# EAGLE design mkii (EAGLE 6.4)
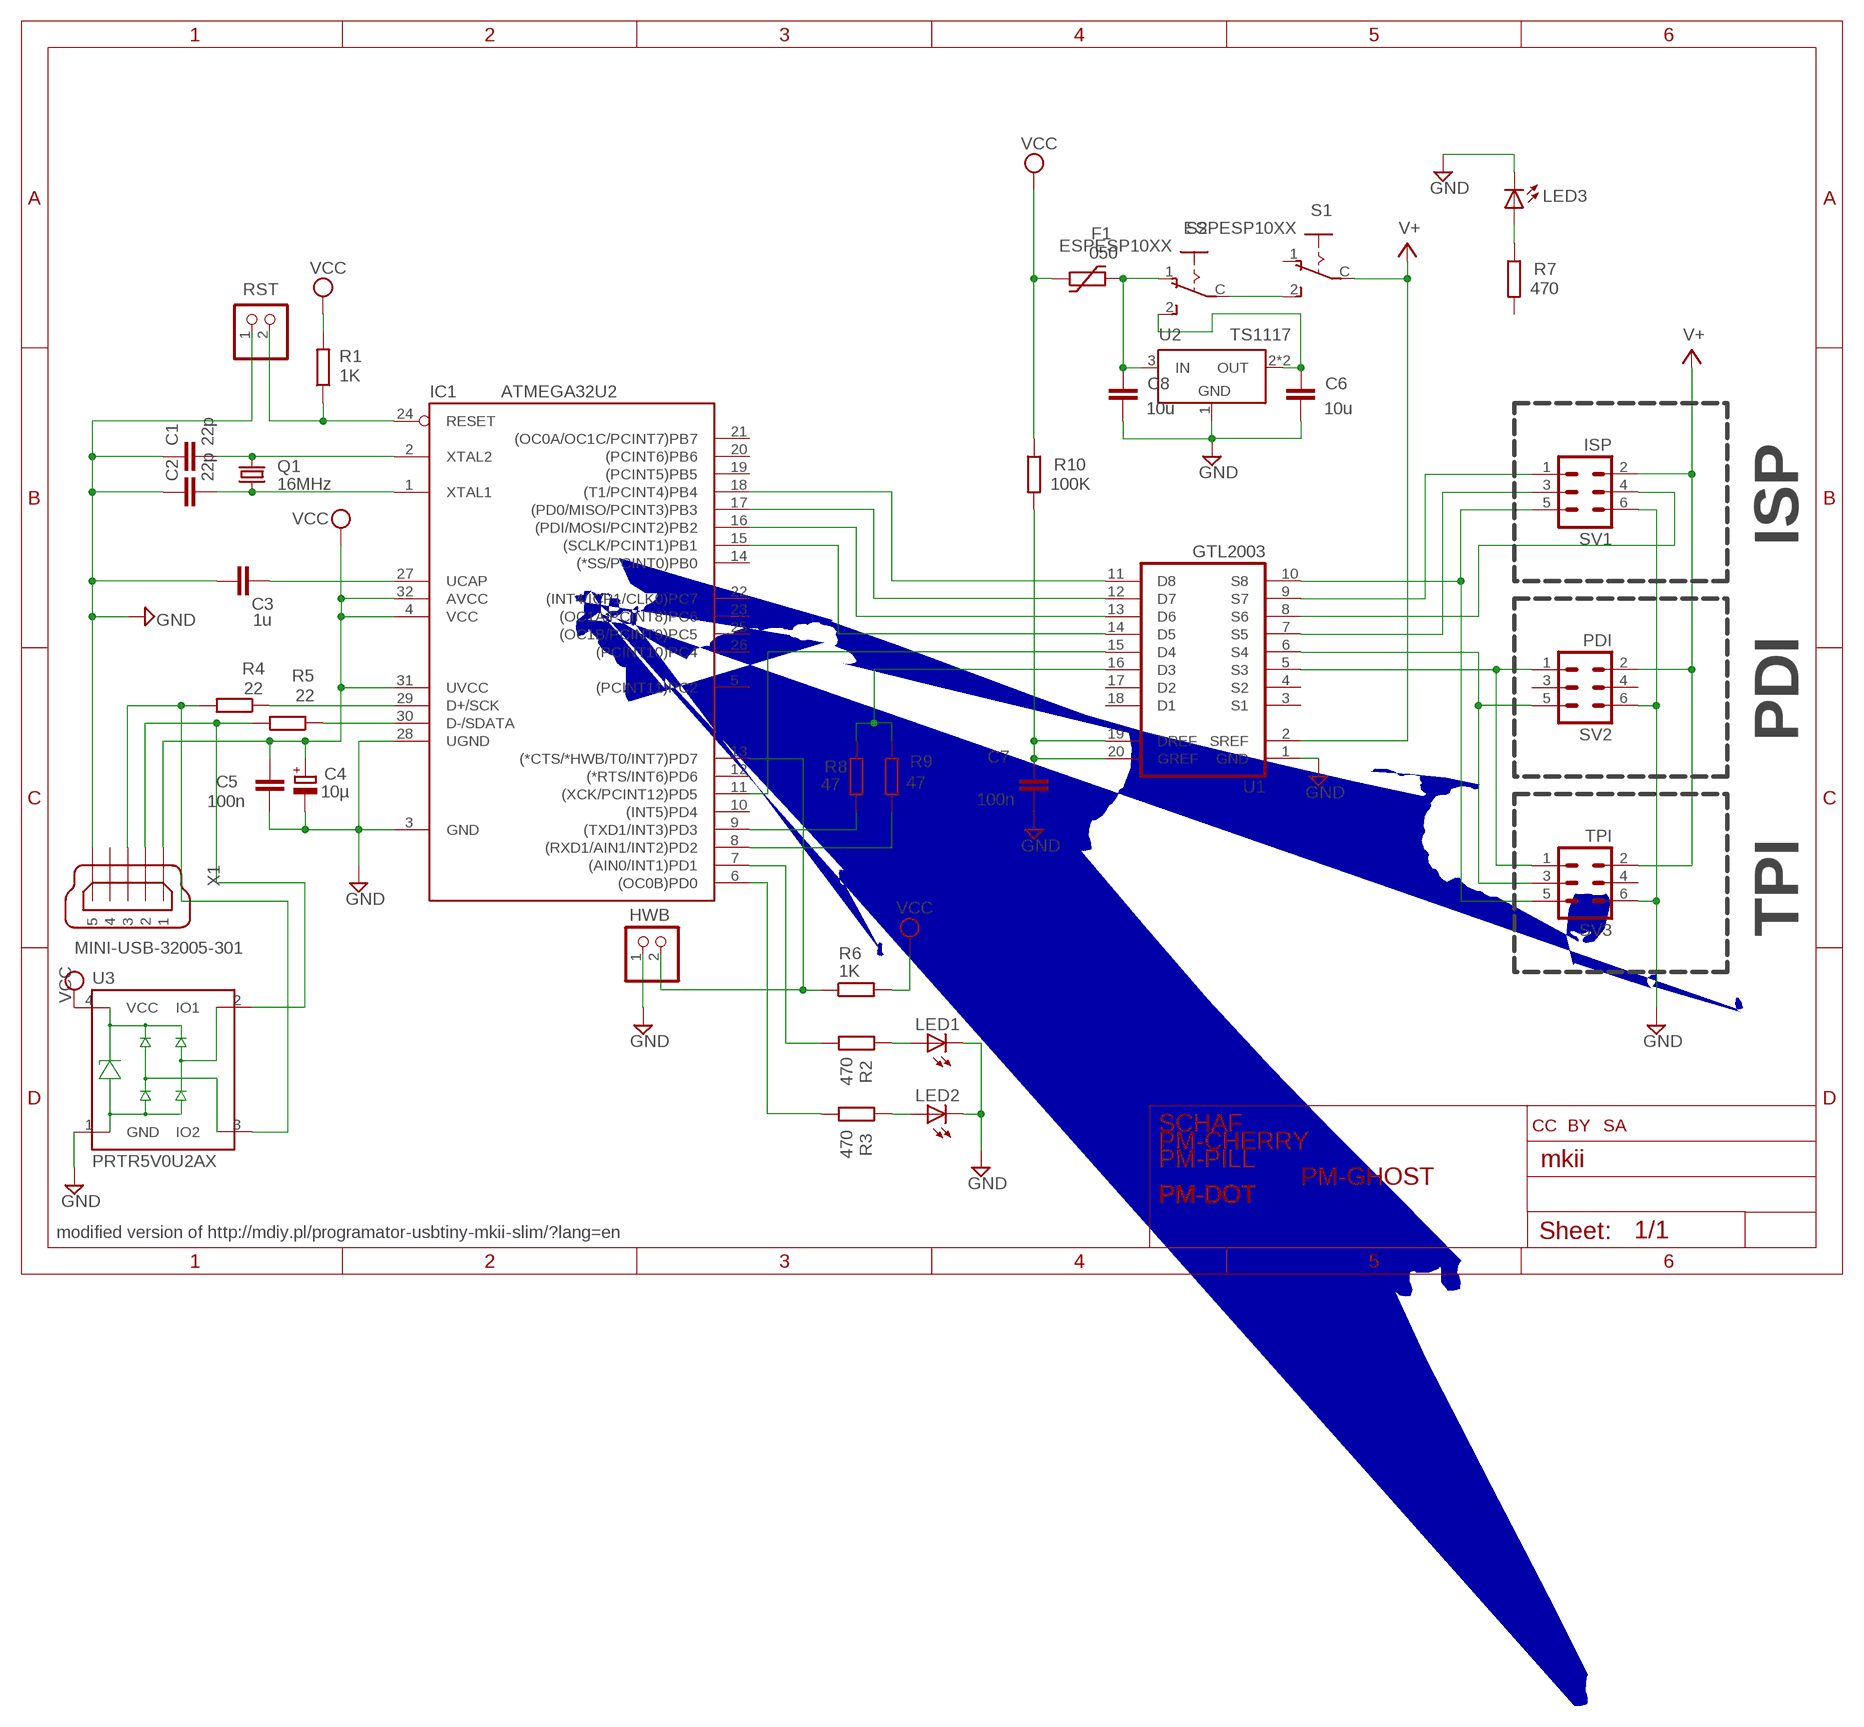
[diagram p0: schematic, sheet 1]

## Parts
C1  22p  C-EUC0603  [C0603]
C2  22p  C-EUC0603  [C0603]
C3  1u  C-EUC0805  [C0805]
C4  10µ  CPOL-EU153CLV-0505  [153CLV-0505]
C5  100n  C-EUC0603  [C0603]
C6  10u  C-EUC0805  [C0805]
C7  100n  C-EUC0603  [C0603]
C8  10u  C-EUC0805  [C0805]
F1  050  1812L  [1812L]
HWB  PINHD-1X02_2.54-S  [1X02-S]
IC1  ATMEGA32U2  AT90USB162-AU  [TQFP32-08]
LED1  LEDCHIP-LED0603  [CHIP-LED0603]
LED2  LEDCHIP-LED0603  [CHIP-LED0603]
LED3  LEDCHIP-LED0603  [CHIP-LED0603]
Q1  16MHz  CRYSTALHC49S  [HC49/S]
R1  1K  R-EU_R0603  [R0603]
R2  470  R-EU_R0603  [R0603]
R3  470  R-EU_R0603  [R0603]
R4  22  R-EU_R0603  [R0603]
R5  22  R-EU_R0603  [R0603]
R6  1K  R-EU_R0603  [R0603]
R7  470  R-EU_R0603  [R0603]
R8  47  R-EU_R0603  [R0603]
R9  47  R-EU_R0603  [R0603]
R10  100K  R-EU_R0603  [R0603]
RST  PINHD-1X02_2.54-S  [1X02-S]
S1  ESPESP10XX  [ESP10XX]
S2  ESPESP10XX  [ESP10XX]
SV1  ISP  ML6  [ML6]
SV2  PDI  ML6  [ML6]
SV3  TPI  ML6  [ML6]
U1  GTL2003  [TSSOP20]
U2  TS1117  [SOT223]
U3  PRTR5V0U2AX  [SOT143B]
U$1  CC-TPLACE-HALF  [CC_TPLACE_HS]
U$2  BY-TPLACE-HS  [BY_TPLACE_HS]
U$3  SA-TPLACE-HALF  [SA_TPLACE_HS]
U$4  SCHAF7MM  [SCHAF-7]
U$5  PM-CHERRY5  [PM-CHERRY-5]
U$6  PM-PILL5  [PM-PILL-5]
U$8  PM-DOT5  [PM-DOT5]
U$9  PM-DOT5  [PM-DOT5]
U$10  PM-DOT5  [PM-DOT5]
U$11  PM-DOT5  [PM-DOT5]
U$12  PM-DOT5  [PM-DOT5]
U$13  PM-DOT5  [PM-DOT5]
U$14  PM-DOT5  [PM-DOT5]
U$15  PM-DOT5  [PM-DOT5]
U$16  PM-GHOSTA5  [PM-GHOSTA-5]
X1  MINI-USB-32005-301  [32005-301]

## Nets
!RST: IC1.24(RESET) R1.1 RST.2
D+: IC1.29(D+/SCK) R4.1
D-: IC1.30(D-/SDATA) R5.1
GND [pwr]: C1.1 C2.1 C3.1 C4.- C5.1 C6.1 C7.1 C8.1 HWB.1 IC1.3(GND) IC1.28(UGND) LED1.C LED2.C LED3.C RST.1 SV1.6 SV2.6 SV3.6 U1.1(GND) U2.1(GND) U3.1(GND) X1.5
HWB: HWB.2 IC1.13((*CTS/*HWB/T0/INT7)PD7) R6.1
N$1: R4.2 U3.3(IO2) X1.3
N$2 [pwr]: S1.2(S) S2.C(P)
N$3: IC1.7((AIN0/INT1)PD1) R2.2
N$4: LED3.A R7.1
N$6 [pwr]: C8.2 F1.P$2 S2.1(O) U2.3(IN)
N$7: R5.2 U3.2(IO1) X1.2
N$9: IC1.9((TXD1/INT3)PD3) R8.2
N$11: IC1.6((OC0B)PD0) R3.2
N$12: LED1.A R2.1
N$13: LED2.A R3.1
N$15: C7.2 R10.2 U1.19(DREF) U1.20(GREF)
N$16: IC1.18((T1/PCINT4)PB4) U1.11(D8)
N$17: IC1.17((PD0/MISO/PCINT3)PB3) U1.12(D7)
N$18: IC1.16((PDI/MOSI/PCINT2)PB2) U1.13(D6)
N$19: IC1.15((SCLK/PCINT1)PB1) U1.14(D5)
N$20: IC1.11((XCK/PCINT12)PD5) U1.15(D4)
N$21: R8.1 R9.1 U1.16(D3)
N$25: SV2.1 SV3.1 U1.5(S3)
N$26: SV2.5 SV3.3 U1.6(S4)
N$27: SV1.5 SV3.5 U1.10(S8)
N$28: SV1.1 U1.9(S7)
N$29: SV1.4 U1.8(S6)
N$30: SV1.3 U1.7(S5)
N$31: IC1.8((RXD1/AIN1/INT2)PD2) R9.2
N$32 [pwr]: C6.2 S2.2(S) U2.2(OUT) U2.4(OUT)
UCAP: C3.2 IC1.27(UCAP)
V+ [pwr]: S1.C(P) SV1.2 SV2.2 SV3.2 U1.2(SREF)
VCC [pwr]: C4.+ C5.2 F1.P$1 IC1.4(VCC) IC1.31(UVCC) IC1.32(AVCC) R1.2 R6.2 R10.1 U3.4(VCC) X1.1
XTAL1: C2.2 IC1.1(XTAL1) Q1.1
XTAL2: C1.2 IC1.2(XTAL2) Q1.2
Unconnected: IC1.5((PCINT11)PC2) IC1.10((INT5)PD4) IC1.12((*RTS/INT6)PD6) IC1.14((*SS/PCINT0)PB0) IC1.19((PCINT5)PB5) IC1.20((PCINT6)PB6) IC1.21((OC0A/OC1C/PCINT7)PB7) IC1.22((INT4/ICP1/CLK0)PC7) IC1.23((OC1A/PCINT8)PC6) IC1.25((OC1B/PCINT9)PC5) IC1.26((PCINT10)PC4) R7.2 S1.1(O) SV2.3 SV2.4 SV3.4 U1.3(S1) U1.4(S2) U1.17(D2) U1.18(D1) X1.4

## Notes on the sheet
- ISP
- PDI
- TPI
- modified version of http://mdiy.pl/programator-usbtiny-mkii-slim/?lang=en

## Library data of the parts
C1-C3 C5-C8 = rcl:C-EU: CAPACITOR, European symbol
C4 = rcl:CPOL-EU: POLARIZED CAPACITOR, European symbol
F1 = ptc-littlefuse:1812L
HWB RST = pinhead-2:PINHD-1X02: PIN HEADER
IC1 = at90usb:AT90USB162-*
LED1-LED3 = led:LED: LED OSRAM: - CHIPLED LG R971, LG N971, LY N971, LG Q971, LY Q971, LO R971, LY R971 LH N974, LH R974 LS Q976, LO Q976, LY Q976 LO Q996 - Hyper CHIPLED LW Q18S LB Q993, LB Q99A, LB R99A - SideLED LS A670, LO A670, LY A670, LG A670, LP A670 LB A673, LV A673, LT A673, LW A673 LH A674 LY A675 LS A676, LA A676, LO A676, LY A676, LW A676 LS A679, LY A679, LG A679 - Hyper Micro SIDELED® LS Y876, LA Y876, LO Y876, LY Y876 LT Y87S - SmartLED LW L88C, LW L88S LB L89C, LB L89S, LG L890 LS L89K, LO L89K, LY L89K LS L896, LA L896, LO L896, LY L896 - TOPLED LS T670, LO T670, LY T670, LG T670, LP T670 LSG T670, LSP T670, LSY T670, LOP T670, LYG T670 LG T671, LOG T671, LSG T671 LB T673, LV T673, LT T673, LW T673 LH T674 LS T676, LA T676, LO T676, LY T676, LB T676, LH T676, LSB T676, LW T676 LB T67C, LV T67C, LT T67C, LS T67K, LO T67K, LY T67K, LW E67C LS E67B, LA E67B, LO E67B, LY E67B, LB E67C, LV E67C, LT E67C LW T67C LS T679, LY T679, LG T679 LS T770, LO T770, LY T770, LG T770, LP T770 LB T773, LV T773, LT T773, LW T773 LH T774 LS E675, LA E675, LY E675, LS T675 LS T776, LA T776, LO T776, LY T776, LB T776 LHGB T686 LT T68C, LB T68C - Hyper Mini TOPLED® LB M676 - Mini TOPLED Santana® LG M470 LS M47K, LO M47K, LY M47K Source: http://www.osram.convergy.de LUXEON: - LUMILED® LXK2-PW12-R00, LXK2-PW12-S00, LXK2-PW14-U00, LXK2-PW14-V00 LXK2-PM12-R00, LXK2-PM12-S00, LXK2-PM14-U00 LXK2-PE12-Q00, LXK2-PE12-R00, LXK2-PE12-S00, LXK2-PE14-T00, LXK2-PE14-U00 LXK2-PB12-K00, LXK2-PB12-L00, LXK2-PB12-M00, LXK2-PB14-N00, LXK2-PB14-P00, LXK2-PB14-Q00 LXK2-PR12-L00, LXK2-PR12-M00, LXK2-PR14-Q00, LXK2-PR14-R00 LXK2-PD12-Q00, LXK2-PD12-R00, LXK2-PD12-S00 LXK2-PH12-R00, LXK2-PH12-S00 LXK2-PL12-P00, LXK2-PL12-Q00, LXK2-PL12-R00 Source: www.luxeon.com KINGBRIGHT: KA-3528ASYC Source: www.kingbright.com
Q1 = crystal:CRYSTAL: CRYSTAL; OC_FARNELL: 1667008; OC_NEWARK: unknown
R1-R10 = rcl:R-EU_: RESISTOR, European symbol
S1 S2 = schalter:ESP
SV1-SV3 = con-ml:ML6: HARTING; OC_FARNELL: unknown; OC_NEWARK: unknown
U1 = manekinen_diy:GTL2003: "8-bit bidirectional low voltage translator"
U2 = TS1117:TS1117
U3 = nxp:PRTR5V0U2AX
U$1 = creative-commons:CC: creatice commons - CC
U$2 = creative-commons:BY: creative commons Attribution - BY
U$3 = creative-commons:SA: creative commons ShareAlike - SA
U$4 = grafiken:SCHAF: Quelle: http://www.schulbilder.org/malvorlage-schaaf-i17791.html
U$5 = grafiken:PM-CHERRY
U$6 = grafiken:PM-PILL
U$8-U$15 = grafiken:PM-DOT
U$16 = grafiken:PM-GHOST
X1 = con-cypressindustries:MINI-USB-: MINI USB-B Conector Source: www.cypressindustries.com; OC_FARNELL: unknown; OC_NEWARK: unknown

## Net classes
0 default: width 0.152 mm
1 pwr: width 0.254 mm

## Board
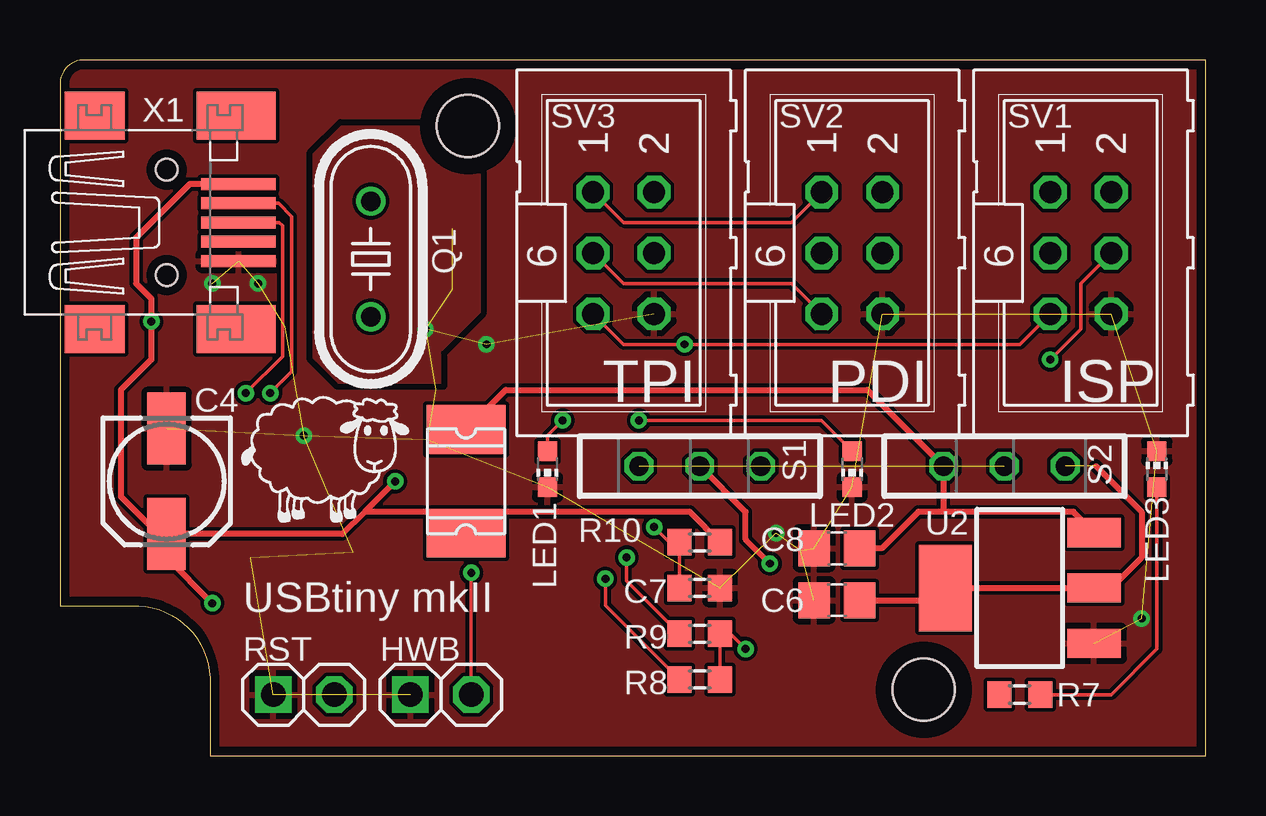
[diagram p1: board, top side]
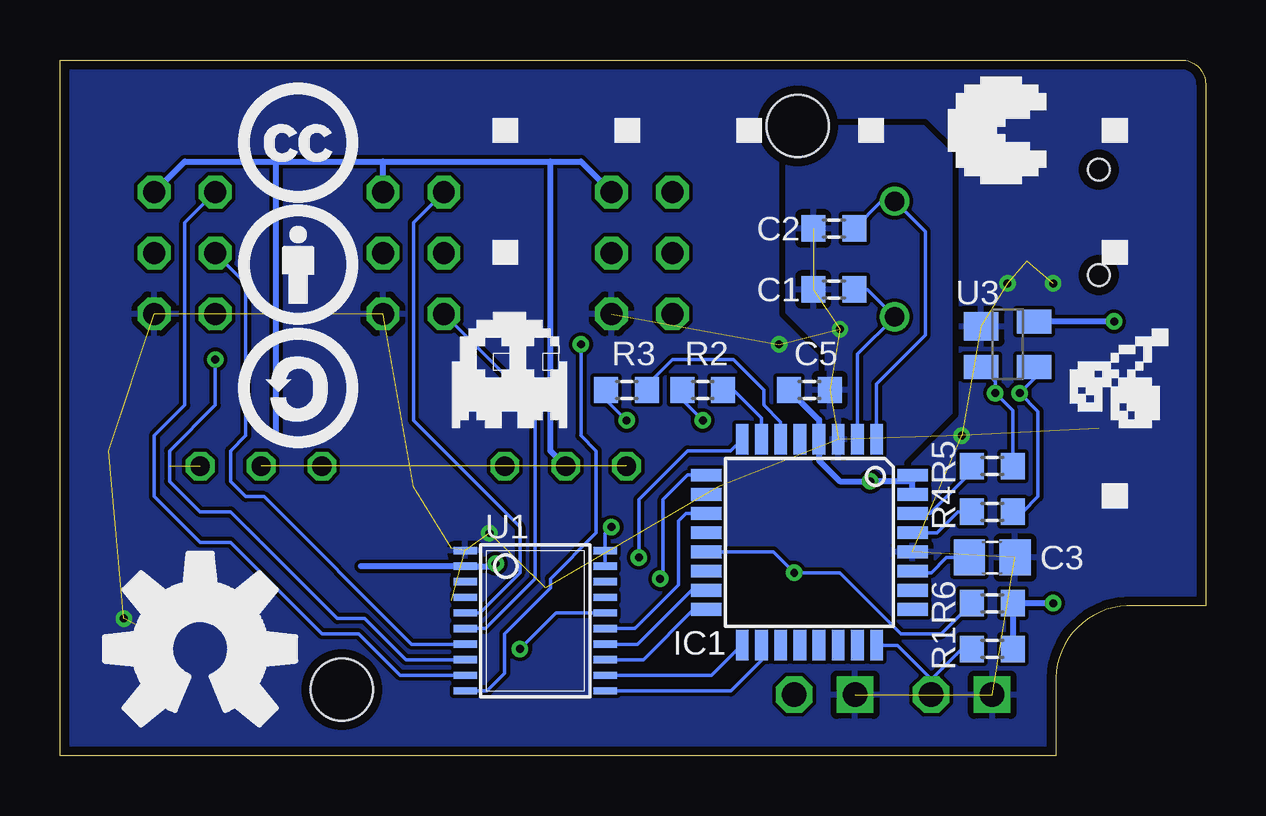
[diagram p2: board, bottom side, seen from below]

Size 47.75 x 29 mm. Coordinates in mm from the lower left corner, seen from the top.
Outline: 0,6.25 3,6.25 arc-90 6.25,3.25 6.25,0 47.75,0 47.75,29 1,29 arc90 0,28 0,6.25
Copper layers (1*16): Top 0.0356mm / dielectric 1.5011mm / Bottom 0.0356mm
Design rules "oshpark": minimum track width 6mil, minimum drill 13mil, track to track 6mil, track to pad 6mil, pad to pad 6mil, via to via 6mil, smd to smd 6mil, copper to edge 15mil, drill to drill 6mil, minimum pad ring 7mil, minimum via ring 7mil, stop-mask expansion 4mil, vias tented up to drill 0mil, thermal gap 10mil
Holes 2.6 mm at 17,26.25 36,2.75
tRestrict: area 34.8,1.5 to 37.2,4; area 15.8,25 to 18.2,27.5; 9 lines
bRestrict: 8 lines

### Footprints (pad centres in the part's own frame; a part is rotated, then mirrored left to right if it is on the bottom)
C0603 = smd 1 x 1.1: 1 -0.85,0; 2 0.85,0
C0805 = smd 1.3 x 1.5: 1 -0.95,0; 2 0.95,0
153CLV-0505 = smd 3 x 1.6: + 2.2,0; - -2.2,0
1812L = smd 2.03 x 3.3: P$1 -2.16,0; P$2 2.16,0
1X02-S = drill 1.016 square: 1 -1.27,0 | drill 1.016 octagon: 2 1.27,0
TQFP32-08 = smd 1.27 x 0.533: 1 -4.293,2.8; 2 -4.293,2; 3 -4.293,1.2; 4 -4.293,0.4; 5 -4.293,-0.4; 6 -4.293,-1.2; 7 -4.293,-2; 8 -4.293,-2.8; 17 4.293,-2.8; 18 4.293,-2; 19 4.293,-1.2; 20 4.293,-0.4; 21 4.293,0.4; 22 4.293,1.2; 23 4.293,2; 24 4.293,2.8 | smd 0.533 x 1.27: 9 -2.8,-4.293; 10 -2,-4.293; 11 -1.2,-4.293; 12 -0.4,-4.293; 13 0.4,-4.293; 14 1.2,-4.293; 15 2,-4.293; 16 2.8,-4.293; 25 2.8,4.293; 26 2,4.293; 27 1.2,4.293; 28 0.4,4.293; 29 -0.4,4.293; 30 -1.2,4.293; 31 -2,4.293; 32 -2.8,4.293
CHIP-LED0603 = smd 0.8 x 0.8: A 0,-0.75; C 0,0.75
HC49/S = drill 0.813: 1 -2.413,0; 2 2.413,0
R0603 = smd 1 x 1.1: 1 -0.85,0; 2 0.85,0
ESP10XX = drill 0.8 octagon: 1 -2.54,0; 2 2.54,0; C 0,0
ML6 = drill 0.914 octagon: 1 -2.54,-1.27; 2 -2.54,1.27; 3 0,-1.27; 4 0,1.27; 5 2.54,-1.27; 6 2.54,1.27
TSSOP20 = smd 0.991 x 0.305: 1 -2.918,2.925; 2 -2.918,2.275; 3 -2.918,1.625; 4 -2.918,0.975; 5 -2.918,0.325; 6 -2.918,-0.325; 7 -2.918,-0.975; 8 -2.918,-1.625; 9 -2.918,-2.275; 10 -2.918,-2.925; 11 2.918,-2.925; 12 2.918,-2.275; 13 2.918,-1.625; 14 2.918,-0.975; 15 2.918,-0.325; 16 2.918,0.325; 17 2.918,0.975; 18 2.918,1.625; 19 2.918,2.275; 20 2.918,2.925
SOT223 = smd 1.219 x 2.235: 1 -2.311,-3.099; 2 0,-3.099; 3 2.311,-3.099 | smd 3.6 x 2.2: 4 0,3.099
SOT143B = smd 1.2 x 1.44: 1 -0.75,-1.1 | smd 1 x 1.44: 2 0.95,-1.1; 3 0.95,1.1; 4 -0.95,1.1
32005-301 = smd 3.1 x 0.5: 1 3,1.6; 2 3,0.8; 3 3,0; 4 3,-0.8; 5 3,-1.6 | smd 2.5 x 2: M1 -3,-4.45; M2 -3,4.45 | smd 3.3 x 2: M3 2.9,4.45; M4 2.9,-4.45 | hole 0.9: 0,2.2; 0,-2.2

### Placement (x,y rotation side)
C1  15.49,19.43 0 bottom
C2  15.49,21.97 0 bottom
C3  8.89,8.26 180 bottom
C4  4.45,11.43 270 top
C5  16.51,15.24 180 bottom
C6  32.38,6.48 0 top
C7  26.67,6.99 180 top
C8  32.38,8.64 0 top
F1  16.92,11.43 90 top
HWB  15.88,2.54 0 top
IC1  16.51,8.89 270 bottom
LED1  20.32,11.94 180 top
LED2  33.02,11.94 180 top
LED3  45.72,11.94 0 top
Q1  12.95,20.7 270 top
R1  8.89,4.45 0 bottom
R2  20.95,15.24 0 bottom
R3  24.13,15.24 0 bottom
R4  8.89,10.16 0 bottom
R5  8.89,12.06 0 bottom
R6  8.89,6.35 0 bottom
R7  40.01,2.54 180 top
R8  26.67,3.17 180 top
R9  26.67,5.08 180 top
R10  26.67,8.89 180 top
RST  10.16,2.54 0 top
S1  26.67,12.06 180 top
S2  39.37,12.06 0 top
SV1  42.55,20.95 270 top
SV2  33.02,20.95 270 top
SV3  23.5,20.95 270 top
U1  27.94,5.62 0 bottom
U2  40.01,6.99 90 top
U3  8.26,17.14 270 bottom
U$1  40.32,23.05 0 bottom
U$2  40.32,17.97 0 bottom
U$3  40.32,12.83 0 bottom
U$4  7.56,9.72 0 top
U$5  6.35,13.34 0 bottom
U$6  11.43,23.5 0 bottom
U$8  6.35,8.26 0 bottom
U$9  16.51,23.5 0 bottom
U$10  21.59,23.5 0 bottom
U$11  6.35,23.5 0 bottom
U$12  26.67,23.5 0 bottom
U$13  6.35,18.41 0 bottom
U$14  31.75,18.41 0 bottom
U$15  31.75,23.5 0 bottom
U$16  31.75,13.34 0 bottom
X1  4.45,22.23 0 top

### Tracks (layer width: path | path; a pad name or v marks a point on that pad's centre or on a via)
!RST
  Bottom 0.152: 13.71,4.18 IC1.24 12.85,4.6 11.43,3.17 | R1.1 10.16,4.45 11.43,3.17 | RST.2 11.43,3.17
D+
  Bottom 0.152: IC1.29 11.2,9.29 10.32,10.16 R4.1
D-
  Bottom 0.152: IC1.30 11.5,10.09 9.74,11.85 R5.1
GND  (via drill 0.33)  (28 unrouted)
  other vias: 29.84,9.27 6.35,19.68 8.26,19.68 15.24,17.78 17.78,17.14 10.16,13.34 45.09,5.71
  pour Top (rank 6): 0,0 0,29 54,29 53.98,0
  pour Bottom (rank 6): -1,30 55,30 55,-1 -1,-1
  pour Top: 14.22,15.24 11.81,15.24 10.67,16.38 10.67,25.02 11.81,26.16 16,26.16 17.14,25.02 17.14,18.29 14.73,15.88
HWB  (via drill 0.33)
  Top 0.152: HWB.2 v17.14,7.62
  Bottom 0.152: R6.1 11.01,5.08 12.7,5.08 15.24,7.62 v17.14,7.62 18.02,8.49 IC1.13
N$1  (via drill 0.33)
  Top 0.152: X1.3 9.14,22.23 9.27,22.1 9.27,16.64 v7.75,15.11
  Bottom 0.152: R4.2 7.62,10.16 6.99,10.79 6.99,14.35 v7.75,15.11 7.16,15.71 U3.3
N$2  (1 unrouted)
N$3
  Bottom 0.152: IC1.7 18.51,14.06 19.68,15.24 R2.2
N$4
  Top 0.152: LED3.A 45.72,4.45 43.81,2.54 R7.1
N$6
  Top 0.254: F1.P$2 18.57,15.24 33.66,15.24 S2.1 36.83,10.16 | 33.02,9.11 C8.2 34.25,8.64 35.77,10.16 36.83,10.16 | U2.3 42.24,10.16 36.83,10.16
N$7  (via drill 0.33)
  Top 0.152: X1.2 9.11,23.02 9.65,22.48 9.65,16 v8.76,15.11
  Bottom 0.152: R5.2 8.04,14.39 v8.76,15.11 8.76,15.6 U3.2
N$9  (via drill 0.33)
  Top 0.152: v22.73,7.37 22.73,6.26 R8.2
  Bottom 0.152: v22.73,7.37 22.61,7.49 22.61,10.67 21.58,11.69 IC1.9
N$11
  Bottom 0.152: IC1.6 17.71,13.9 18.41,14.61 18.41,15.24 19.68,16.51 22.23,16.51 23.28,15.46 R3.2
N$12  (via drill 0.33)
  Top 0.152: v20.95,13.97 20.32,13.34 LED1.A
  Bottom 0.152: R2.1 21.8,14.82 v20.95,13.97
N$13  (via drill 0.33)
  Top 0.152: v24.13,13.97 31.74,13.97 LED2.A
  Bottom 0.152: R3.1 24.98,14.82 v24.13,13.97
N$15  (via drill 0.33)
  Top 0.152: C7.2 R10.2 25.82,8.47 v24.77,9.53
  Bottom 0.152: v24.77,9.53 25.02,9.27 U1.20 U1.19
N$16
  Bottom 0.152: IC1.18 18.51,3.97 19.78,2.69 U1.11
N$17
  Bottom 0.152: IC1.17 19.33,4.62 20.6,3.35 U1.12
N$18
  Bottom 0.152: IC1.16 21.34,6.09 23.44,4 U1.13
N$19
  Bottom 0.152: U1.14 23.68,4.64 21.43,6.89 IC1.15
N$20
  Bottom 0.152: U1.15 23.79,5.29 21.97,7.11 21.97,9.78 21.66,10.09 IC1.11 21.28,10.09
N$21  (via drill 0.33)
  Top 0.152: v28.57,4.45 27.94,5.08 R9.1 R8.1
  Bottom 0.152: U1.16 27.07,5.95 v28.57,4.45
N$25
  Top 0.152: SV3.1 23.5,22.23 30.48,22.23 SV2.1
  Bottom 0.152: SV2.1 33.02,22.23 33.02,13.97 28.57,9.53 28.57,7.62 30.25,5.95 U1.5
N$26
  Top 0.152: SV2.5 30.48,19.68 23.5,19.68 SV3.3
  Bottom 0.152: U1.6 30.01,5.29 27.94,7.37 27.94,14.61 SV2.5
N$27  (via drill 0.33)
  Top 0.152: SV1.5 40.01,17.14 v26.04,17.14 23.5,17.14 SV3.5
  Bottom 0.152: v26.04,17.14 26.04,13.34 25.4,12.7 25.4,9.27 27.3,7.37 27.3,6.99 29.21,5.08 29.21,3.43 29.94,2.69 U1.10
N$28
  Bottom 0.152: U1.9 33.57,3.35 35.31,5.08 36.83,5.08 40.64,8.89 41.91,8.89 43.81,10.79 43.81,13.34 42.55,14.61 42.55,22.23 SV1.1
N$29  (via drill 0.33)
  Top 0.152: v41.27,16.51 42.55,17.78 42.55,19.68 SV1.4
  Bottom 0.152: U1.8 33.33,4 35.05,5.71 36.2,5.71 40.64,10.16 41.91,10.16 43.18,11.43 43.18,12.7 41.27,14.61 v41.27,16.51
N$30
  Bottom 0.152: U1.7 33.09,4.64 39.24,10.79 40.01,10.79 40.64,11.43 40.64,12.7 40.01,13.34 40.01,19.68 SV1.3
N$31  (via drill 0.33)
  Top 0.152: R9.2 23.62,7.28 v23.62,8.26
  Bottom 0.152: v23.62,8.26 23.62,10.67 21.59,12.7 19.79,12.7 IC1.8
N$32  (1 unrouted)
  Top 0.254: 43.18,12.06 45.09,10.16 45.09,8.26 43.81,6.99 U2.2 U2.4 36.91,6.48 C6.2
UCAP
  Bottom 0.152: IC1.27 12.15,7.62 11.43,7.62 10.79,8.26 C3.2
V+  (via drill 0.33)
  Top 0.254: v29.59,8 28.57,9.02 28.57,10.16 S1.C
  Bottom 0.254: 35.2,7.89 U1.2 29.7,7.89 v29.59,8 | SV1.2 42.55,24.77 38.73,24.77 | 38.73,24.77 34.29,24.77 | 34.29,24.77 27.3,24.77 | 27.3,24.77 26.04,24.77 SV3.2 | SV2.2 34.29,24.77 | 38.73,13.34 38.73,24.77 | S1.C 27.3,12.7 27.3,24.77
VCC  (via drill 0.33)
  Top 0.254: X1.1 5.41,23.82 3.17,21.59 3.17,19.68 3.81,19.05 v3.81,18.09 3.81,16.51 2.54,15.24 2.54,10.79 3.81,9.53 4.15,9.53 C4.+ | C4.+ 4.45,8.26 v6.35,6.35 | v13.97,11.43 12.7,10.16 | 12.7,10.16 11.77,9.23 C4.+ | R10.1 26.25,10.16 16.92,10.16 | 16.92,10.16 12.7,10.16 | F1.P$1 16.92,10.16
  Bottom 0.254: IC1.32 IC1.31 12.22,11.43 v13.97,11.43 15.24,11.43 16.11,12.3 IC1.4 16.11,13.99 C5.2 | v6.35,6.35 R6.2 R1.2 | v3.81,18.09 U3.4
XTAL1
  Bottom 0.152: C2.2 13.5,23.11 Q1.1 11.68,21.84 11.68,17.53 13.71,15.5 IC1.1
XTAL2
  Bottom 0.152: C1.2 14.1,19.43 Q1.2 14.51,16.73 IC1.2

### Text on the board
tPlace: USBtiny mkII